# Altium schematic sheet Client_Node_1.SchDoc: Client_Node_1
size A4; DrawnBy: Project_Vega_Team; Revision: 1; SheetNumber: 7; SheetTotal: 7
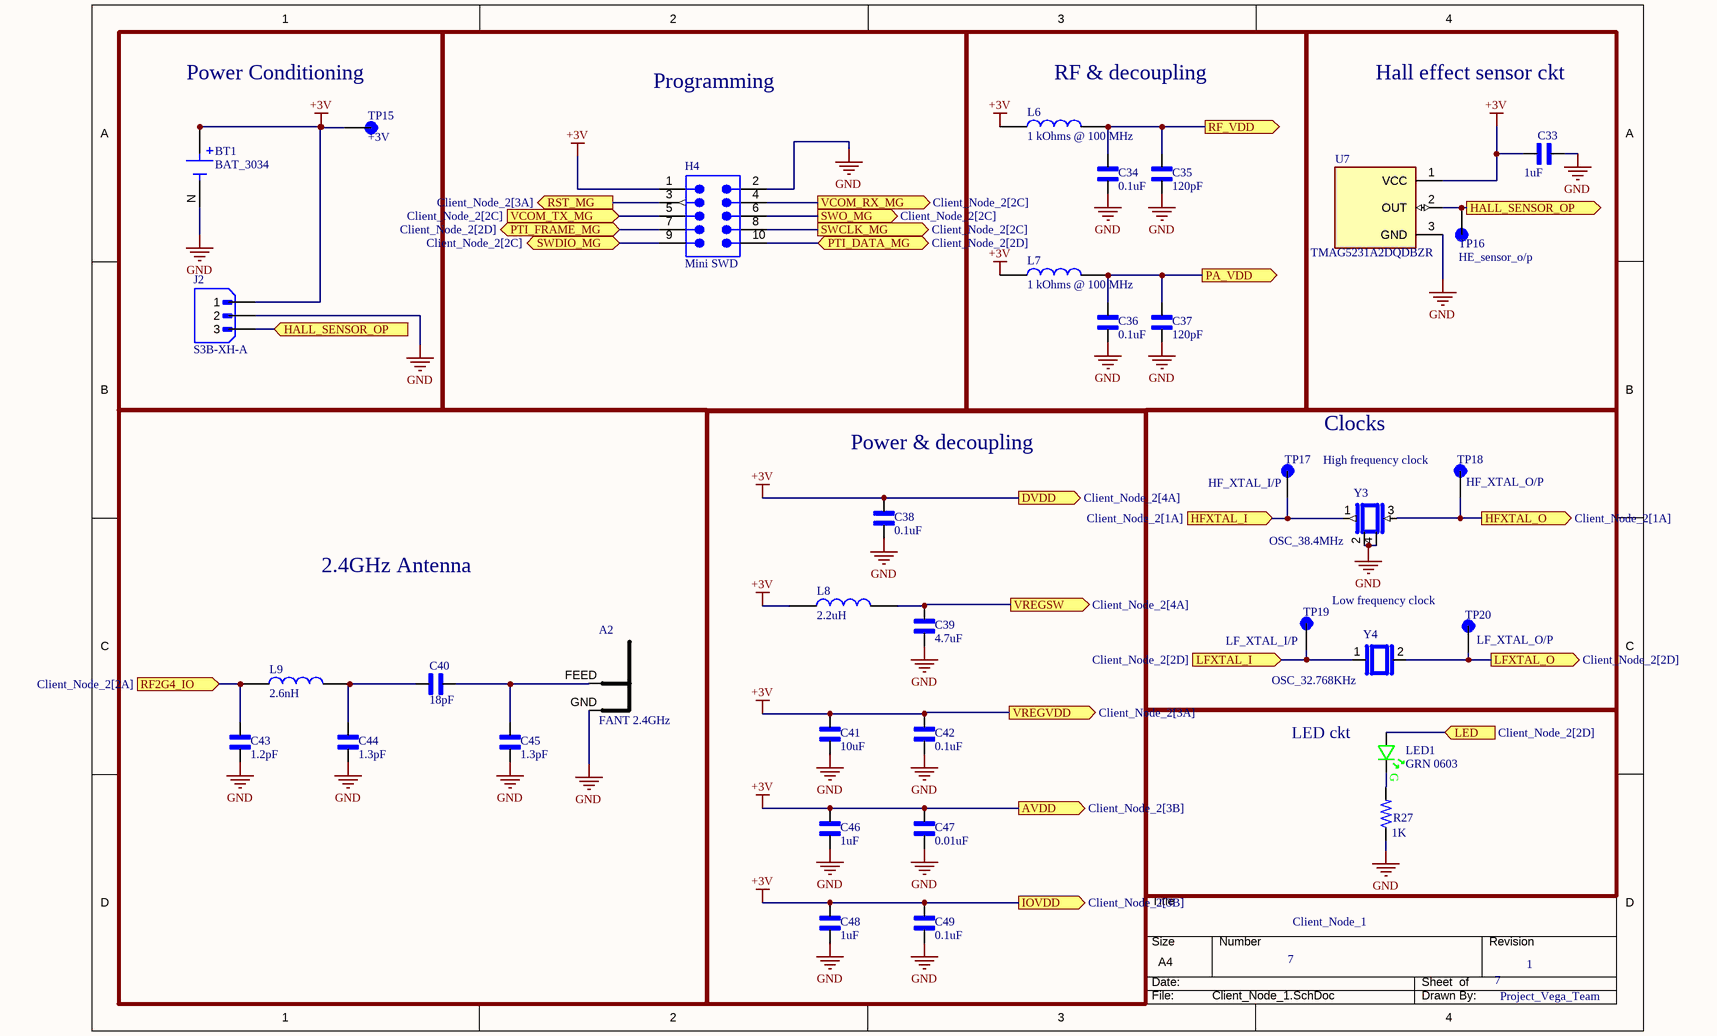
[diagram p0: Client_Node_1.SchDoc]

## Parts
A2  FANT 2.4GHz  [FANT_2P4]
BT1  BAT_3034  [BAT_3034]
C33  1uF  [CAPC1608X90]
C34  0.1uF  [CAPC1608X90]
C35  120pF  [CAPC1608X90]
C36  0.1uF  [CAPC1608X90]
C37  120pF  [CAPC1608X90]
C38  0.1uF  [CAPC1608X90]
C39  4.7uF  [CAPC1608X90]
C40  18pF  [CAPC1608X90]
C41  10uF  [CAPC1608X90]
C42  0.1uF  [CAPC1608X90]
C43  1.2pF  [CAPC1608X90]
C44  1.3pF  [CAPC1608X90]
C45  1.3pF  [CAPC1608X90]
C46  1uF  [CAPC1608X90]
C47  0.01uF  [CAPC1608X90]
C48  1uF  [CAPC1608X90]
C49  0.1uF  [CAPC1608X90]
H4  Mini SWD  [FTSH-105-01-XXX-DV-K]
J2  S3B-XH-A  [JST_S3B-XH-A]
L6  1 kOhms @ 100 MHz  [INDC1608X95N]
L7  1 kOhms @ 100 MHz  [INDC1608X95N]
L8  2.2uH  [INDC1608X95N]
L9  2.6nH  [INDC1608X95N]
LED1  GRN 0603  [LED_0603_GRN_WL-SMCW]
R27  1K  [RES_0603]
TP15  +3V  [TP]
TP16  HE_sensor_o/p  [TP]
TP17  HF_XTAL_I/P  [TP]
TP18  HF_XTAL_O/P  [TP]
TP19  LF_XTAL_I/P  [TP]
TP20  LF_XTAL_O/P  [TP]
U7  TMAG5231A2DQDBZR  [SOT95P237X112-3N]
Y3  OSC_38.4MHz  [OSC_38.4MHz]
Y4  OSC_32.768KHz  [OSC_32.768KHz]

## Blocks framed on the sheet
Power Conditioning: BT1 J2 TP15
Programming: H4
RF & decoupling: C34-C37 L6 L7
Hall effect sensor ckt: C33 TP16 U7
2.4GHz Antenna: A2 C40 C43-C45 L9
Clocks: TP17-TP20 Y3 Y4
Power & decoupling: C38 C39 C41 C42 C46-C49 L8
LED ckt: LED1 R27

## Ports
AVDD (out, see Client_Node_2[3B]), DVDD (out, see Client_Node_2[4A]), HALL_SENSOR_OP (in, see Client_Node_1[4A], Client_Node_2[2D]), HALL_SENSOR_OP (out, see Client_Node_1[1B], Client_Node_2[2D]), HFXTAL_I (in, see Client_Node_2[1A]), HFXTAL_O (out, see Client_Node_2[1A]), IOVDD (out, see Client_Node_2[3B]), LED (in, see Client_Node_2[2D]), LFXTAL_I (in, see Client_Node_2[2D]), LFXTAL_O (out, see Client_Node_2[2D]), PA_VDD (out), PTI_DATA_MG (bidir, see Client_Node_2[2D]), PTI_FRAME_MG (bidir, see Client_Node_2[2D]), RF2G4_IO (in, see Client_Node_2[2A]), RF_VDD (out), RST_MG (out, see Client_Node_2[3A]), SWCLK_MG (out, see Client_Node_2[2C]), SWDIO_MG (bidir, see Client_Node_2[2C]), SWO_MG (out, see Client_Node_2[2C]), VCOM_RX_MG (out, see Client_Node_2[2C]), VCOM_TX_MG (in, see Client_Node_2[2C]), VREGSW (out, see Client_Node_2[4A]), VREGVDD (out, see Client_Node_2[3A])

## Nets
+3V: BT1.P1(POS) BT1.P2(POS) C33.2 C38.1 C41.1 C42.1 C46.1 C47.1 C48.1 C49.1 H4.1 J2.1 L6.1 L7.1 L8.1 TP15.TP U7.1(VCC) ; port DVDD, port VREGVDD, port AVDD, port IOVDD
GND: A2.GND BT1.N(NEG) C33.1 C34.2 C35.2 C36.2 C37.2 C38.2 C39.2 C41.2 C42.2 C43.2 C44.2 C45.2 C46.2 C47.2 C48.2 C49.2 H4.2 J2.2 R27.1 U7.3(GND) Y3.2 Y3.4
HALL_SENSOR_OP: J2.3 TP16.TP U7.2(OUT) ; port HALL_SENSOR_OP
HFXTAL_I: TP17.TP Y3.1 ; port HFXTAL_I
HFXTAL_O: TP18.TP Y3.3 ; port HFXTAL_O
LED: LED1.A ; port LED
LFXTAL_I: TP19.TP Y4.1 ; port LFXTAL_I
LFXTAL_O: TP20.TP Y4.2 ; port LFXTAL_O
PA_VDD: C36.1 C37.1 L7.2 ; port PA_VDD
PTI_DATA_MG: H4.10 ; port PTI_DATA_MG
PTI_FRAME_MG: H4.7 ; port PTI_FRAME_MG
RF2G4_IO: C43.1 L9.1 ; port RF2G4_IO
RF_VDD: C34.1 C35.1 L6.2 ; port RF_VDD
RST_MG: H4.3 ; port RST_MG
SWCLK_MG: H4.8 ; port SWCLK_MG
SWDIO_MG: H4.9 ; port SWDIO_MG
SWO_MG: H4.6 ; port SWO_MG
VCOM_RX_MG: H4.4 ; port VCOM_RX_MG
VCOM_TX_MG: H4.5 ; port VCOM_TX_MG
VREGSW: C39.1 L8.2 ; port VREGSW
NetA2_FEED: A2.FEED C40.2 C45.1
NetC40_1: C40.1 C44.1 L9.2
NetLED1_C: LED1.C R27.2

## Notes on the sheet
- (near TP18) High frequency clock
- Low frequency clock
- THIS DOCUMENT AND THE DATA DISCLOSED HEREIN OR
- HEREWITH IS THE PROPERTY OF ALTIUM LIMITED AND MAY
- DWG NO:
- REVISION
- REV:
- DESCRIPTION
- DATE
- APPROVED
- BE FREELY DISTRIBUTED IN WHOLE. NO RIGHTS ARE
- RESERVED OR EXPRESS OR IMPLIED WARANTEE GIVEN.
- ENG:
- APPROVALS
- PROJECT
- DSN:
- CHK:
- REFERENCE DOCUMENTS
- PROJECT REVISION:
- TITLE
- DOCUMENT REVISION:
- DESIGN ITEM:
- BOM:
- FAB DWG:
- PCB DWG:
- ASSY DWG:
- SCALE:
- A3
- SIZE
- CAGE CODE
- FILE NAME
- DWG NO.
- SHEET
- OF
- REV
- (in symbol LED_green) G

## Library data of the parts
A2 = FANT_2P4: Inverted F antenna
BT1 = BAT_3034: SMT Holder for 20mm Cell-Tin Nickel Plate; MP: 3034; MF: Keystone Electronics Corp.; SnapEDA_Link: https://www.snapeda.com/parts/3034/Keystone+Electronics/view-part/?ref=snap; Price: None; Check_prices: https://www.snapeda.com/parts/3034/Keystone+Electronics/view-part/?ref=eda; Availability: Not in stock; Value: *; Package: None; Supplier 1: Digikey; Supplier Part Number 1: 36-3034-ND
C33-C49 = CC0603KRX7R9BB104: 0.1 ÂµF Â±10% 50V Ceramic Capacitor X7R 0603 (1608 Metric); MF: Yageo; SnapEDA_Link: https://www.snapeda.com/parts/CC0603KRX7R9BB104/Yageo/view-part/?ref=snap; Package: 0603 Yageo; Value: *; MP: CC0603KRX7R9BB104; Check_prices: https://www.snapeda.com/parts/CC0603KRX7R9BB104/Yageo/view-part/?ref=eda; Supplier 1: Digikey
  C33 C38 C42 C46 C48 C49: Supplier Part Number 1: 445-12472-1-ND
  C34 C36: Supplier Part Number 1: 445-7456-1-ND
  C35 C37: Supplier Part Number 1: 399-C0603C121J5GACTUCT-ND
  C39: Supplier Part Number 1: 399-C0603C475K9PAC7867CT-ND
  C40: Supplier Part Number 1: 490-14486-1-ND
  C41: Supplier Part Number 1: 490-7202-1-ND
  C43: Supplier Part Number 1: 490-GRM0335C1H1R2WA01DCT-ND
  C44 C45: Supplier Part Number 1: 490-6120-1-ND
  C47: Supplier Part Number 1: 311-4054-1-ND
H4 = Debug Connector Mini SWD - 0.05": Mini SWD 0.05" Pitch Connector - 10 Pin SMT Box Header; Manufacturer: Adafruit Industries; Manufacturer Part Number: 4048; RoHS: No; Category: Connectors; Stock 1: 201; Pricing 1: 1=1.95000 (USD); ComponentLink1URL: https://media.digikey.com/pdf/Data%20Sheets/Adafruit%20PDFs/4048_Web.pdf?src-supplier=Digi-Key; ComponentLink1Description: https://media.digikey.com/pdf/Data%20Sheets/Adafruit%20PDFs/4048_Web.pdf?src-supplier=Digi-Key; Supplier 1: Digikey; Supplier Part Number 1: 1528-2827-ND
J2 = S3B-XH-A: Connector Header Through Hole 3 position 0.098 (2.50mm); MF: JST Sales; MP: B3B-XH-A(LF)(SN); SnapEDA_Link: https://www.snapeda.com/parts/B3B-XH-A(LF)(SN)/JST+Sales+America+Inc./view-part/?ref=snap; Package: None; Value: *; Check_prices: https://www.snapeda.com/parts/B3B-XH-A(LF)(SN)/JST+Sales+America+Inc./view-part/?ref=eda; Supplier 1: Digikey; Supplier Part Number 1: 455-S3B-XH-A-ND
L6-L9 = LQM18DN100M70L: Inductor with Inductance 10uH Tol.+/-20% Package 0603 (1608); MF: Murata Electronics; MP: LQM18DN100M70L; Price: None; SnapEDA_Link: https://www.snapeda.com/parts/LQM18DN100M70L/Murata/view-part/4834755/?ref=snap; Package: 0603 Murata; Availability: Unavailable; Value: *
  L6: Supplier 1: Digikey; Supplier Part Number 1: 490-1015-1-ND
  L8: Supplier 1: Digikey; Supplier Part Number 1: 732-14076-1-ND
  L9: Supplier 1: Digikey; Supplier Part Number 1: 490-13907-1-ND
LED1 = LED_green: LED, 0603, GREEN, 430MCD, 520NM; Manufacturer: Wurth Electronics; Manufacturer Part Number: 150060GS75000; Dynamic Catalog: 0603 Rectangle with Flat Top Chip LEDs; 3D Model: SMCW_0603.igs / SMCW_0603.stp / SMCW_0603.wrl; Wavelength - Peak: 515nm; Voltage - Forward (Vf) (Typ): 3.2V; Current - Test: 20mA; Viewing Angle: 140°; Lens Type: Clear; Lens Style/Size: Rectangle with Flat Top, 1.1mm x 0.7mm; Other Names: 732-4971-2; Supplier 1: Digi-Key; Stock 1: 34964; Pricing 1: 1=0.14, 50=0.129, 100=0.11, 500=0.095 (USD); Standard Package: 4,000; Category: Optoelectronics; Family: LED Indication - Discrete; Series: WL-SMCW; Packaging: Tape & Reel (TR); Color: Green; Wavelength - Dominant: 520nm; Millicandela Rating: 430mcd; Package / Case: 0603 (1608 Metric); Size / Dimension: 1.60mm L x 0.80mm W; Height: 0.70mm; Mounting Type: Surface Mount; Online Catalog: 0603 Rectangle with Flat Top Chip LEDs; ComponentLink1URL: https://katalog.we-online.de/led/datasheet/150060GS75000.pdf?src-supplier=Digi-Key; ComponentLink1Description: https://katalog.we-online.de/led/datasheet/150060GS75000.pdf?src-supplier=Digi-Key; ComponentLink2URL: http://www.produktinfo.conrad.com/datenblaetter/750000-774999/759427-da-01-en-CHIPLED_0603_W_KL_GRUEN_150060GS75000.pdf?src-supplier=Conrad; ComponentLink2Description: http://www.produktinfo.conrad.com/datenblaetter/750000-774999/759427-da-01-en-CHIPLED_0603_W_KL_GRUEN_150060GS75000.pdf?src-supplier=Conrad; Supplier Part Number 1: 732-4971-1-ND
R27 = RES_0603: Thick film general purpose resistor 0603; MP: RC0603JR-070RL; Availability: Unavailable; Package: None; Value: *; Price: None; Supplier 1: Digikey; Supplier Part Number 1: A106049CT-ND
TP15-TP20 = Test_point: SMT Test Point- Mininature-1000 pc Reels; MP: 5019; MF: Keystone Electronics; Value: *; Availability: In Stock; Purchase-URL: https://pricing.snapeda.com/search/part/5019/?ref=eda; Package: None; Price: None
U7 = TMAG5231A2DQDBZR: SOT-23-3-Digital Switch Omnipolar Switch Push-Pull Hall Effect; MF: {'manufacturer': u'Texas Instruments'}; Package: None; Price: None; Value: *; MP: TMAG5231A2DQDBZR; Availability: Unavailable; Supplier 1: Digikey; Supplier Part Number 1: 296-TMAG5231A2DQDBZRCT-ND
Y3 = OSC_38.4MHz: 38.4 MHz ±10ppm Crystal 10pF 40 Ohms 4-SMD, No Lead; MF: {'manufacturer': u'Murata Electronics'}; MP: XRCGB38M400F2P00R0; Package: None; Price: None; Value: *; Availability: Unavailable; Supplier 1: Digikey; Supplier Part Number 1: 4606-TZ3398BCT-ND
Y4 = OSC_32.768KHz: Tuning Fork Crystal 32.768kHz in 1.2 x 2.0mm package; MF: Micro Crystal; MP: CM8V-T1A-32.768KHZ-7PF-20PPM-TA-QC; Package: SMD-2 Micro Crystal; Price: None; Value: *; SnapEDA_Link: https://www.snapeda.com/parts/CM8V-T1A-32.768KHZ-7PF-20PPM-TA-QC/Micro+Crystal/view-part/?ref=snap; Availability: Not in stock; Check_prices: https://www.snapeda.com/parts/CM8V-T1A-32.768KHZ-7PF-20PPM-TA-QC/Micro+Crystal/view-part/?ref=eda; Supplier 1: Digikey; Supplier Part Number 1: 2195-CM8V-T1A-32.768KHZ-7PF-20PPM-TA-QCCT-ND